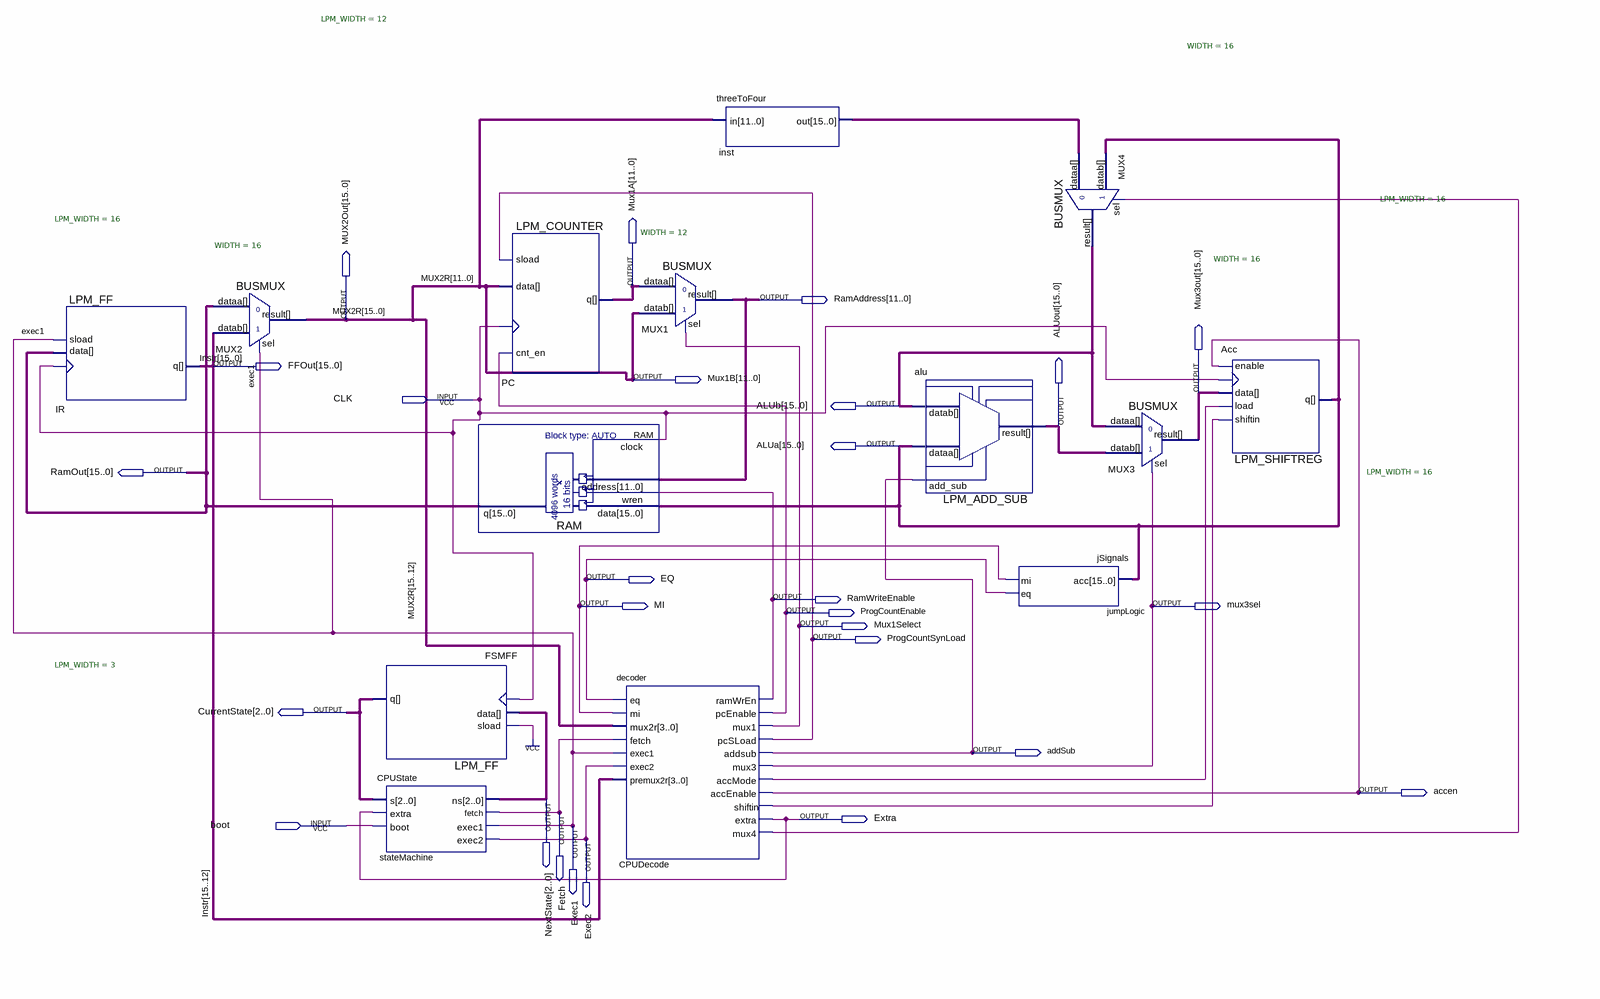
[diagram p0: schematic sheet]
// Quartus schematic MU0CPU.bdf as structural Verilog: 14 symbols, 27 pins
module MU0CPU (
  input  CLK,
  input  boot,
  output [11:0] Mux1A,
  output [11:0] RamAddress,
  output [15:0] MUX2Out,
  output [15:0] FFOut,
  output [11:0] Mux1B,
  output [15:0] Mux3out,
  output [15:0] ALUb,
  output [15:0] ALUout,
  output [15:0] ALUa,
  output [15:0] RamOut,
  output EQ,
  output RamWriteEnable,
  output MI,
  output mux3sel,
  output ProgCountEnable,
  output Mux1Select,
  output ProgCountSynLoad,
  output [2:0] CurrentState,
  output addSub,
  output accen,
  output [2:0] NextState,
  output Fetch,
  output Extra,
  output Exec1,
  output Exec2
);

  wire CPUDecode_accmode, CPUDecode_mux4, CPUDecode_shiftin;
  wire [15:0] inst_out;

  LPM_FF #(.LPM_WIDTH(16)) IR (.clock(CLK), .sload(Exec1), .data(RamOut), .q(FFOut));
  BUSMUX #(.WIDTH(16)) MUX2 (.datab(FFOut), .sel(Exec1), .dataa(RamOut), .result({MUX2Out[15:12], Mux1B}));
  LPM_FF #(.LPM_WIDTH(3)) FSMFF (.clock(CLK), .sload(1'b1), .data(NextState), .q(CurrentState));
  CPUState stateMachine (
    .s(CurrentState), .extra(Extra), .boot(boot), .ns(NextState), .fetch(Fetch), .exec1(Exec1), .exec2(Exec2));
  RAM RAM (.data(ALUa), .wren(RamWriteEnable), .address(RamAddress), .clock(CLK), .q(RamOut));
  LPM_COUNTER #(.LPM_WIDTH(12)) PC (
    .sload(ProgCountSynLoad), .data(Mux1B), .clock(CLK), .cnt_en(ProgCountEnable), .q(Mux1A));
  BUSMUX #(.WIDTH(12)) MUX1 (.datab(Mux1B), .sel(Mux1Select), .dataa(Mux1A), .result(RamAddress));
  decoder CPUDecode (
    .eq(EQ), .mi(MI), .mux2r(MUX2Out[15:12]), .fetch(Fetch), .exec1(Exec1), .exec2(Exec2),
    .premux2r(FFOut[15:12]), .ramWrEn(RamWriteEnable), .pcEnable(ProgCountEnable), .mux1(Mux1Select),
    .pcSLoad(ProgCountSynLoad), .addsub(addSub), .mux3(mux3sel), .accMode(CPUDecode_accmode),
    .accEnable(accen), .shiftin(CPUDecode_shiftin), .extra(Extra), .mux4(CPUDecode_mux4));
  threeToFour inst (.in(Mux1B), .out(inst_out));
  LPM_ADD_SUB #(.LPM_WIDTH(16)) alu (.datab(ALUb), .add_sub(addSub), .dataa(ALUa), .result(ALUout));
  jSignals jumpLogic (.acc(ALUa), .mi(MI), .eq(EQ));
  BUSMUX #(.WIDTH(16)) MUX4 (.datab(ALUa), .sel(CPUDecode_mux4), .dataa(inst_out), .result(ALUb));
  BUSMUX #(.WIDTH(16)) MUX3 (.datab(ALUout), .sel(mux3sel), .dataa(ALUb), .result(Mux3out));
  LPM_SHIFTREG #(.LPM_WIDTH(16)) Acc (
    .shiftin(CPUDecode_shiftin), .enable(accen), .clock(CLK), .data(Mux3out), .load(CPUDecode_accmode),
    .q(ALUa));

  assign MUX2Out[11:0] = Mux1B;

  // Other names for the same wires on the sheet: Instr[15:0] = FFOut; MUX2R[15:0] = {MUX2Out[15:12], Mux1B}
endmodule
